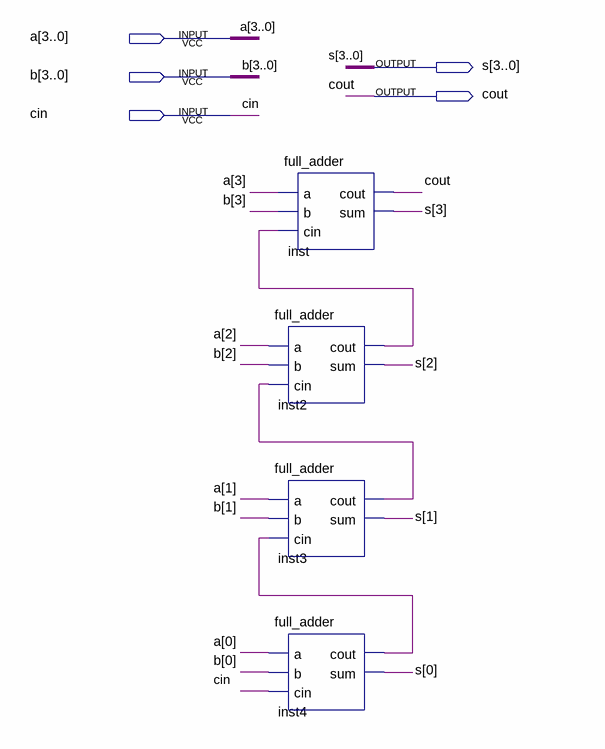
[diagram p0: schematic sheet]
// Quartus schematic ripple_carry_adder.bdf as structural Verilog: 4 symbols, 5 pins
module ripple_carry_adder (
  input  [3:0] a,
  input  [3:0] b,
  input  cin,
  output [3:0] s,
  output cout
);

  wire inst2_cout, inst3_cout, inst4_cout;

  full_adder inst2 (.a(a[2]), .b(b[2]), .cin(inst3_cout), .cout(inst2_cout), .sum(s[2]));
  full_adder inst3 (.a(a[1]), .b(b[1]), .cin(inst4_cout), .cout(inst3_cout), .sum(s[1]));
  full_adder inst4 (.a(a[0]), .b(b[0]), .cin(cin), .cout(inst4_cout), .sum(s[0]));
  full_adder inst (.a(a[3]), .b(b[3]), .cin(inst2_cout), .cout(cout), .sum(s[3]));
endmodule
